# Altium schematic sheet STM8L Remote Schematic.SchDoc
size A
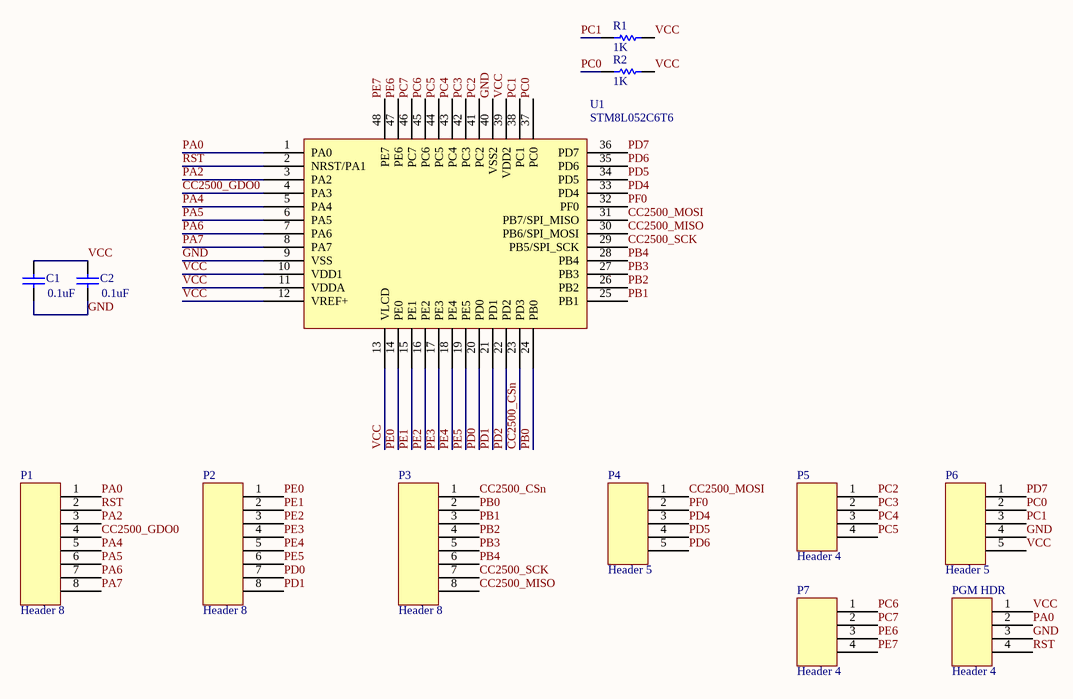
[diagram p0: STM8L Remote Schematic.SchDoc]

## Parts
C1  0.1uF  [0805]
C2  0.1uF  [0805]
P1  Header 8  [HEADER 8 W/O BORDER]
P2  Header 8  [HEADER 8 W/O BORDER]
P3  Header 8  [HEADER 8 W/O BORDER]
P4  Header 5  [HEADER 5 W/O BORDER]
P5  Header 4  [HEADER 4 W/O BORDER]
P6  Header 5  [HEADER 5 W/O BORDER]
P7  Header 4  [HEADER 4 W/O BORDER]
PGM_HDR  Header 4  [HEADER 4 W/O BORDER]
R1  1K  [ERA-0805]
R2  1K  [ERA-0805]
U1  STM8L052C6T6  [STM8L052C6-SQFP50P900X900X1600-48N]

## Nets
CC2500_CSn: P3.1 U1.23(PD3)
CC2500_GDO0: P1.4 U1.4(PA3)
CC2500_MISO: P3.8 U1.30(PB6/SPI_MOSI)
CC2500_MOSI: P4.1 U1.31(PB7/SPI_MISO)
CC2500_SCK: P3.7 U1.29(PB5/SPI_SCK)
GND: C1.2 C2.1 P6.4 PGM_HDR.3 U1.9(VSS) U1.40(VSS2)
PA0: P1.1 PGM_HDR.2 U1.1(PA0)
PA2: P1.3 U1.3(PA2)
PA4: P1.5 U1.5(PA4)
PA5: P1.6 U1.6(PA5)
PA6: P1.7 U1.7(PA6)
PA7: P1.8 U1.8(PA7)
PB0: P3.2 U1.24(PB0)
PB1: P3.3 U1.25(PB1)
PB2: P3.4 U1.26(PB2)
PB3: P3.5 U1.27(PB3)
PB4: P3.6 U1.28(PB4)
PC0: P6.2 R2.1 U1.37(PC0)
PC1: P6.3 R1.1 U1.38(PC1)
PC2: P5.1 U1.41(PC2)
PC3: P5.2 U1.42(PC3)
PC4: P5.3 U1.43(PC4)
PC5: P5.4 U1.44(PC5)
PC6: P7.1 U1.45(PC6)
PC7: P7.2 U1.46(PC7)
PD0: P2.7 U1.20(PD0)
PD1: P2.8 U1.21(PD1)
PD2: U1.22(PD2)
PD4: P4.3 U1.33(PD4)
PD5: P4.4 U1.34(PD5)
PD6: P4.5 U1.35(PD6)
PD7: P6.1 U1.36(PD7)
PE0: P2.1 U1.14(PE0)
PE1: P2.2 U1.15(PE1)
PE2: P2.3 U1.16(PE2)
PE3: P2.4 U1.17(PE3)
PE4: P2.5 U1.18(PE4)
PE5: P2.6 U1.19(PE5)
PE6: P7.3 U1.47(PE6)
PE7: P7.4 U1.48(PE7)
PF0: P4.2 U1.32(PF0)
RST: P1.2 PGM_HDR.4 U1.2(NRST/PA1)
VCC: C1.1 C2.2 P6.5 PGM_HDR.1 R1.2 R2.2 U1.10(VDD1) U1.11(VDDA) U1.12(VREF+) U1.13(VLCD) U1.39(VDD2)

## Library data of the parts
C1 C2 = C0805: Ceramic Chip Capacitor - Standard; Note: Footprint corresponds to dimensions for bulk cassette packaging. This case size has tightened tolerances.; Published: 17-Jul-2002; LatestRevisionDate: 19-Mar-2004; LatestRevisionNote: Silkscreen size reduced.; DatasheetDocument: Mar-2001; PackageDocument: Mar-2001; PackageReference: 0805; Publisher: Altium Limited; Code_JEITA: 0805; Code_IPC: 2012[0805]; ComponentLink1Description: Manufacturer Link; ComponentLink1URL: http://www.kemet.com/; ComponentLink2Description: Datasheet; ComponentLink2URL: http://www.kemet.com/kemet/web/homepage/kechome.nsf/vapubfilesname/F3102TA.pdf/$file/F3102TA.pdf; Value: 0.1uF
R1 R2 = ERA6Y: Rectangular Thick Film Chip Resistor, 10 Ohm to 1M Ohm Range, 0.1% and 0.5% Tolerance, 0805 Size, 0.1 W; Note: If flow soldering, adjust pad width of PCB Footprint to 0.7 - 0.8 times the width of the resistor.; Published: 17-Dec-2003; LatestRevisionDate: 19-Mar-2004; LatestRevisionNote: Silkscreen size reduced.; PackageDocument: Mar-2003; PackageReference: ERA-0805; Publisher: Altium Limited; Code_IPC: 2012 [0805]; ComponentLink1Description: Manufacturer Link; ComponentLink1URL: http://www.panasonic.com/industrial/components/resistive_products.htm; ComponentLink2Description: Datasheet; ComponentLink2URL: http://www.panasonic.com/industrial/components/pdf/AOA0000CE8.pdf; Value: 1K